# EAGLE schematic MF2015 (EAGLE 7.1.0)
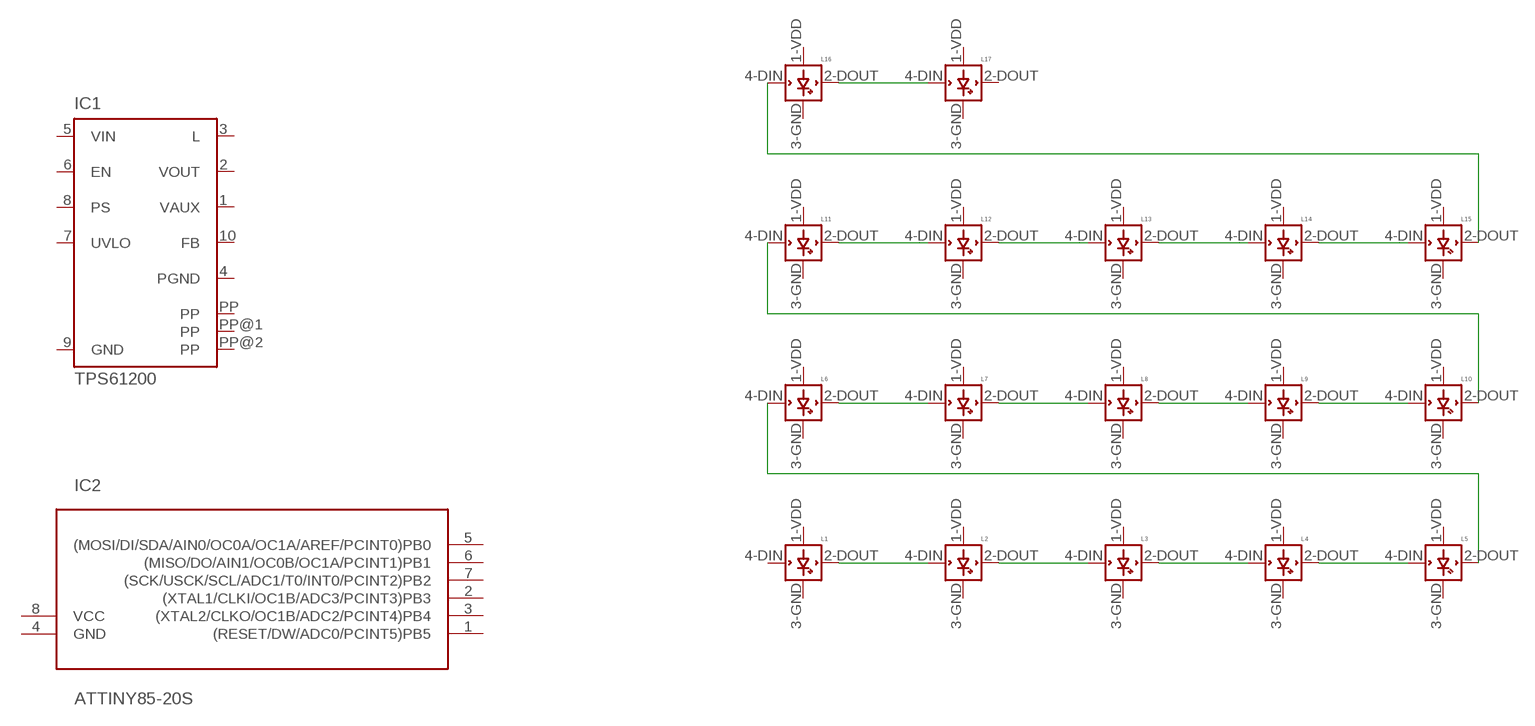
[diagram p0: schematic, sheet 1]

## Parts
IC1  TPS61200  [S-PDSO-N10]
IC2  ATTINY85-20S  [SOIC8]
L1  WS2812B  [WS2812B]
L2  WS2812B  [WS2812B]
L3  WS2812B  [WS2812B]
L4  WS2812B  [WS2812B]
L5  WS2812B  [WS2812B]
L6  WS2812B  [WS2812B]
L7  WS2812B  [WS2812B]
L8  WS2812B  [WS2812B]
L9  WS2812B  [WS2812B]
L10  WS2812B  [WS2812B]
L11  WS2812B  [WS2812B]
L12  WS2812B  [WS2812B]
L13  WS2812B  [WS2812B]
L14  WS2812B  [WS2812B]
L15  WS2812B  [WS2812B]
L16  WS2812B  [WS2812B]
L17  WS2812B  [WS2812B]

## Nets
N$1: L1.2-DOUT(DOUT) L2.4-DIN(DIN)
N$2: L2.2-DOUT(DOUT) L3.4-DIN(DIN)
N$3: L3.2-DOUT(DOUT) L4.4-DIN(DIN)
N$4: L4.2-DOUT(DOUT) L5.4-DIN(DIN)
N$5: L5.2-DOUT(DOUT) L6.4-DIN(DIN)
N$6: L6.2-DOUT(DOUT) L7.4-DIN(DIN)
N$7: L7.2-DOUT(DOUT) L8.4-DIN(DIN)
N$8: L8.2-DOUT(DOUT) L9.4-DIN(DIN)
N$9: L9.2-DOUT(DOUT) L10.4-DIN(DIN)
N$10: L10.2-DOUT(DOUT) L11.4-DIN(DIN)
N$11: L11.2-DOUT(DOUT) L12.4-DIN(DIN)
N$12: L12.2-DOUT(DOUT) L13.4-DIN(DIN)
N$13: L13.2-DOUT(DOUT) L14.4-DIN(DIN)
N$14: L14.2-DOUT(DOUT) L15.4-DIN(DIN)
N$15: L15.2-DOUT(DOUT) L16.4-DIN(DIN)
N$16: L16.2-DOUT(DOUT) L17.4-DIN(DIN)
Unconnected: IC1.1(VAUX) IC1.2(VOUT) IC1.3(L) IC1.5(VIN) IC1.6(EN) IC1.7(UVLO) IC1.8(PS) IC1.10(FB) IC2.1((RESET/DW/ADC0/PCINT5)PB5) IC2.2((XTAL1/CLKI/OC1B/ADC3/PCINT3)PB3) IC2.3((XTAL2/CLKO/OC1B/ADC2/PCINT4)PB4) IC2.4(GND) IC2.5((MOSI/DI/SDA/AIN0/OC0A/OC1A/AREF/PCINT0)PB0) IC2.6((MISO/DO/AIN1/OC0B/OC1A/PCINT1)PB1) IC2.7((SCK/USCK/SCL/ADC1/T0/INT0/PCINT2)PB2) IC2.8(VCC) L1.1-VDD(VDD) L1.3-GND(GND) L1.4-DIN(DIN) L2.1-VDD(VDD) L2.3-GND(GND) L3.1-VDD(VDD) L3.3-GND(GND) L4.1-VDD(VDD) L4.3-GND(GND) L5.1-VDD(VDD) L5.3-GND(GND) L6.1-VDD(VDD) L6.3-GND(GND) L7.1-VDD(VDD) L7.3-GND(GND) L8.1-VDD(VDD) L8.3-GND(GND) L9.1-VDD(VDD) L9.3-GND(GND) L10.1-VDD(VDD) L10.3-GND(GND) L11.1-VDD(VDD) L11.3-GND(GND) L12.1-VDD(VDD) L12.3-GND(GND) L13.1-VDD(VDD) L13.3-GND(GND) L14.1-VDD(VDD) L14.3-GND(GND) L15.1-VDD(VDD) L15.3-GND(GND) L16.1-VDD(VDD) L16.3-GND(GND) L17.1-VDD(VDD) L17.2-DOUT(DOUT) L17.3-GND(GND)

## Power pins joined to a net without a drawn wire
GND: IC1.9(GND)
PGND: IC1.4(PGND)
PP: IC1.PP IC1.PP@1(PP) IC1.PP@2(PP)

## Library data of the parts
IC1 = texas:TPS6120*: LOW INPUT VOLTAGE SYNCHRONOUS BOOST CONVERTER WITH 1.3-A SWITCHES Source: http://focus.ti.com/lit/ds/symlink/tps61200.pdf; MPN: TPS61200DRCT; OC_FARNELL: 1471238; OC_NEWARK: 37M0066
IC2 = avr:ATTINY85: MICROCONTROLLER 8 Kbytes FLASH 512 bytes EEPROM 512 bytes RAM 4-channel 10 bit ADC USI
L1-L17 = adafruit:WS2812B